# EAGLE schematic mainboard (EAGLE 8.7.1)
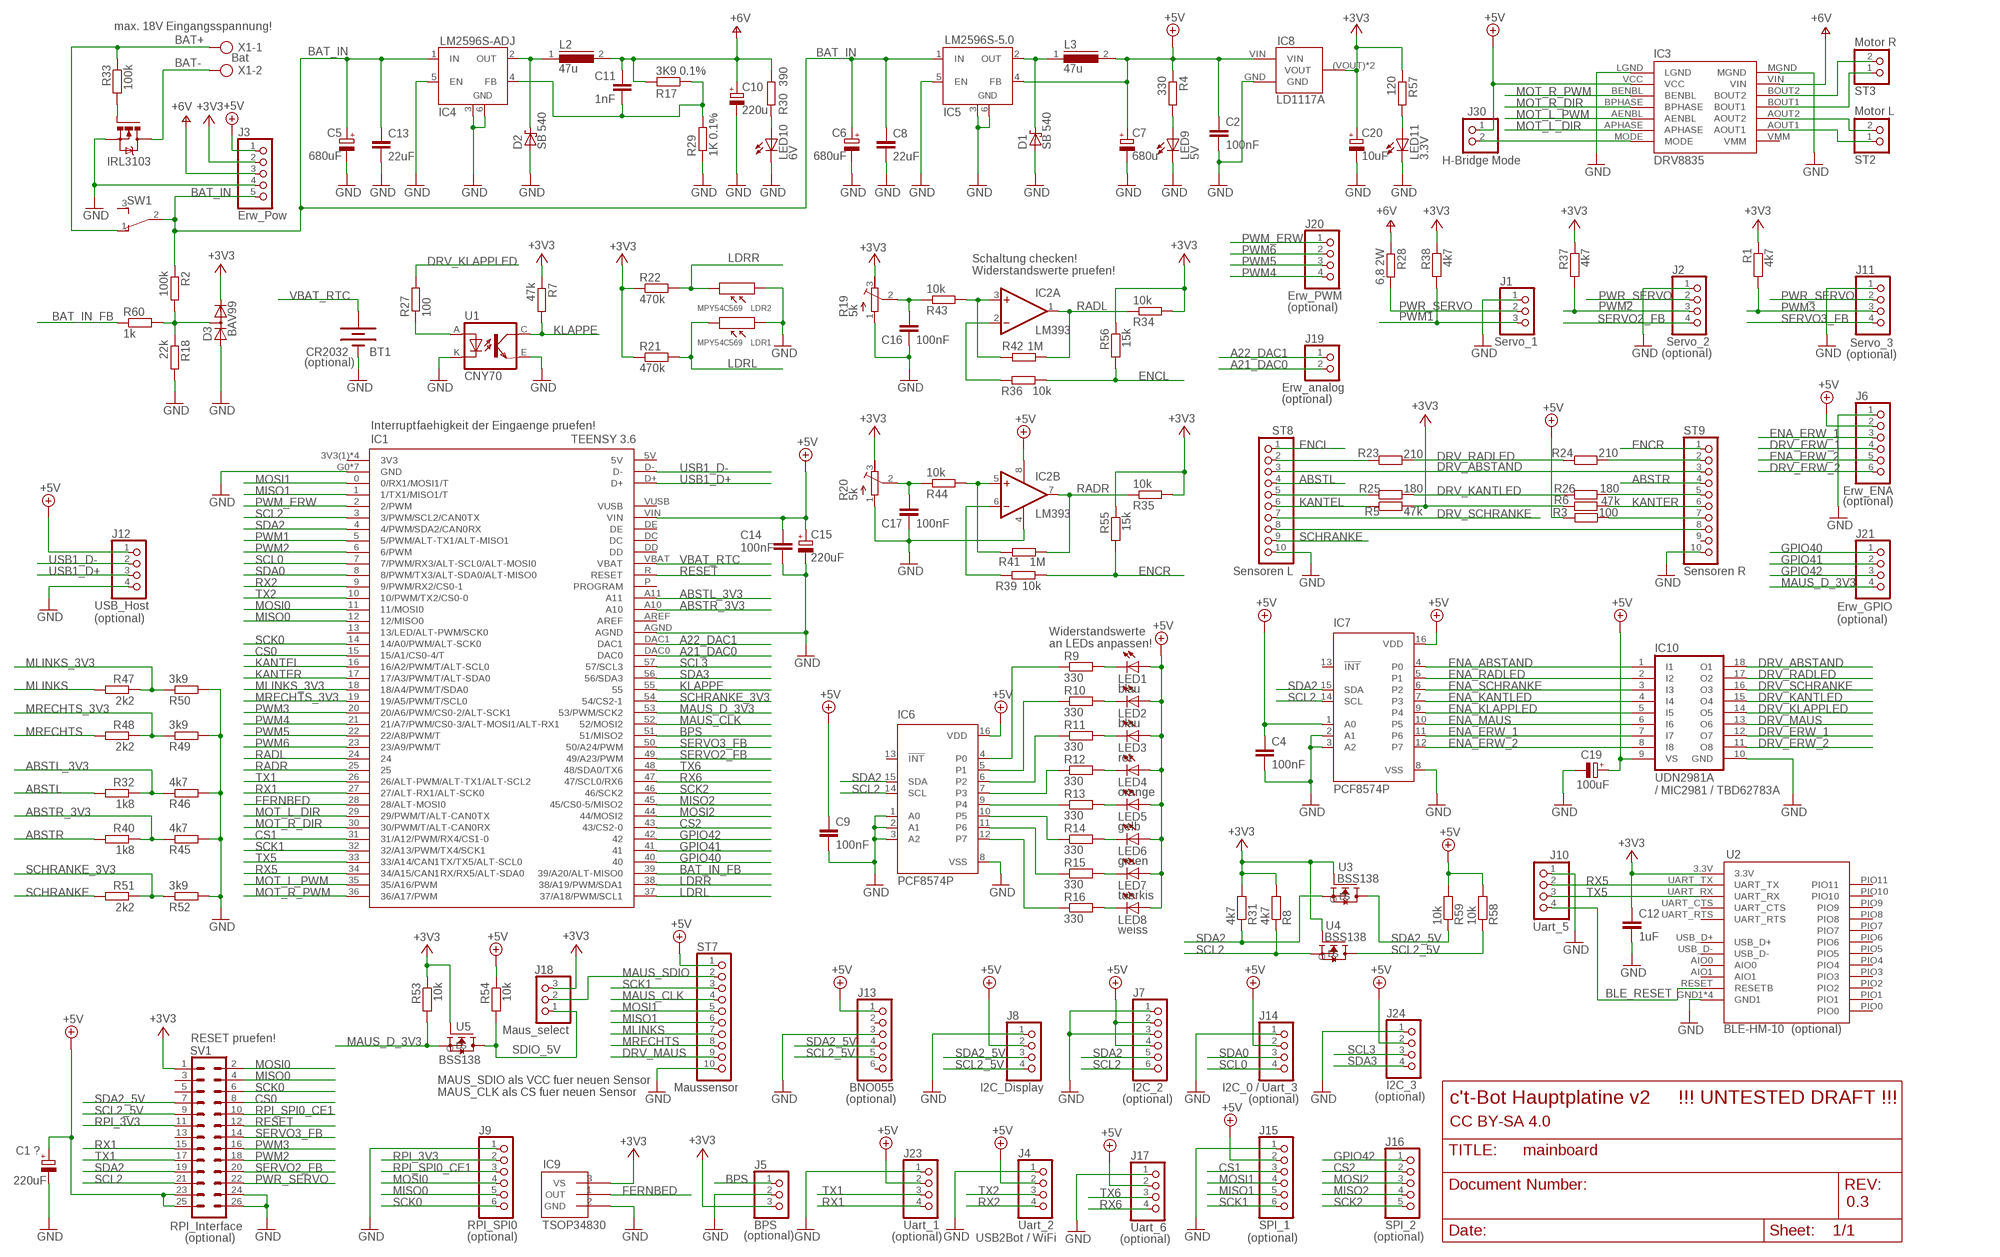
[diagram p0: schematic, sheet 1]

## Parts
BT1  CR2032  BATTERY-20MM_PTH  [BATTCOM_20MM_PTH]
C1  220uF  CPOL-EUE2-5  [E2-5]
C2  100nF  C-EU025-025X050  [C025-025X050]
C4  100nF  C-EU025-025X050  [C025-025X050]
C5  680uF  CPOL-EUE5-10.5  [E5-10,5]
C6  680uF  CPOL-EUE5-10.5  [E5-10,5]
C7  680u  CPOL-EUE5-10.5  [E5-10,5]
C8  22uF  C-EU025-025X050  [C025-025X050]
C9  100nF  C-EU025-025X050  [C025-025X050]
C10  220u  CPOL-EUE5-10.5  [E5-10,5]
C11  1nF  C-EU025-025X050  [C025-025X050]
C12  1uF  C-EU025-025X050  [C025-025X050]
C13  22uF  C-EU025-025X050  [C025-025X050]
C14  100nF  C-EU025-025X050  [C025-025X050]
C15  220uF  CPOL-EUE2-5  [E2-5]
C16  100nF  C-EU025-025X050  [C025-025X050]
C17  100nF  C-EU025-025X050  [C025-025X050]
C19  100uF  CPOL-EUE2-5  [E2-5]
C20  10uF  CPOL-EUE2.5-5  [E2,5-5]
D1  SB 540  SCHOTTKY-DIODEDO201T15  [DO201T15]
D2  SB 540  SCHOTTKY-DIODEDO201T15  [DO201T15]
D3  BAV99  BAV199  [SOT23]
IC1  TEENSY 3.6  TEENSY3_6--ALLPINS  [T36]
IC2  LM393  LM393N  [DIL08@1]
IC3  DRV8835  POLOLU_MOTOR_DRV8835THROUGHHOLE  [POLOLU_MOTOR_DRV_DRV8835]
IC4  LM2596S-ADJ  LM2596S  [TO263-5]
IC5  LM2596S-5.0  LM2596S  [TO263-5]
IC6  PCF8574P  [DIL16]
IC7  PCF8574P  [DIL16]
IC8  LD1117A  LD1117  [LD1117SOT-223]
IC9  TSOP34830  [TSOP348]
IC10  UDN2981A  [DIL18]
J1  Servo_1  PINHD-1X3  [1X03]
J2  Servo_2  PINHD-1X4  [1X04]
J3  Erw_Pow  PINHD-1X5  [1X05]
J4  Uart_2  PINHD-1X4  [1X04]
J5  BPS  PINHD-1X3  [1X03]
J6  Erw_ENA  PINHD-1X6  [1X06]
J7  I2C_2  PINHD-1X6  [1X06]
J8  I2C_Display  PINHD-1X4  [1X04]
J9  RPI_SPI0  PINHD-1X6  [1X06]
J10  Uart_5  PINHD-1X4  [1X04]
J11  Servo_3  PINHD-1X4  [1X04]
J12  USB_Host  PINHD-1X4  [1X04]
J13  BNO055  PINHD-1X6  [1X06]
J14  I2C_0 / Uart_3  PINHD-1X4  [1X04]
J15  SPI_1  PINHD-1X6  [1X06]
J16  SPI_2  PINHD-1X5  [1X05]
J17  Uart_6  PINHD-1X4  [1X04]
J18  Maus_select  PINHD-1X3  [1X03]
J19  Erw_analog  PINHD-1X2  [1X02]
J20  Erw_PWM  PINHD-1X4  [1X04]
J21  Erw_GPIO  PINHD-1X4  [1X04]
J23  Uart_1  PINHD-1X4  [1X04]
J24  I2C_3  PINHD-1X4  [1X04]
J30  H-Bridge Mode  PINHD-1X2  [1X02]
L2  47u  09HCP  [09HCP]
L3  47u  09HCP  [09HCP]
LDR1  MPY54C569  PHOTORESISTOR-5528-10K(2P-5.0X4.2MM)  [SNR2-3.0]
LDR2  MPY54C569  PHOTORESISTOR-5528-10K(2P-5.0X4.2MM)  [SNR2-3.0]
LED1  blau  LED3MM  [LED3MM]
LED2  blau  LED3MM  [LED3MM]
LED3  rot  LED3MM  [LED3MM]
LED4  orange  LED3MM  [LED3MM]
LED5  gelb  LED3MM  [LED3MM]
LED6  gruen  LED3MM  [LED3MM]
LED7  tuerkis  LED3MM  [LED3MM]
LED8  weiss  LED3MM  [LED3MM]
LED9  5V  LED3MM  [LED3MM]
LED10  6V  LED3MM  [LED3MM]
LED11  3.3V  LED3MM  [LED3MM]
Q2  IRL3103  IRF740  [TO220BV]
R1  4k7  R-EU_0204/2V  [0204V]
R2  100k  R-EU_0204/2V  [0204V]
R3  100  R-EU_0204/2V  [0204V]
R4  330  R-EU_0204/2V  [0204V]
R5  47k  R-EU_0204/2V  [0204V]
R6  47k  R-EU_0204/2V  [0204V]
R7  47k  R-EU_0204/2V  [0204V]
R8  4k7  R-EU_0204/2V  [0204V]
R9  330  R-EU_0204/2V  [0204V]
R10  330  R-EU_0204/2V  [0204V]
R11  330  R-EU_0204/2V  [0204V]
R12  330  R-EU_0204/2V  [0204V]
R13  330  R-EU_0204/2V  [0204V]
R14  330  R-EU_0204/2V  [0204V]
R15  330  R-EU_0204/2V  [0204V]
R16  330  R-EU_0204/2V  [0204V]
R17  3K9 0.1%  R-EU_0204/2V  [0204V]
R18  22k  R-EU_0204/2V  [0204V]
R19  5k  R-TRIMM64W  [RTRIM64W]
R20  5k  R-TRIMM64W  [RTRIM64W]
R21  470k  R-EU_0204/2V  [0204V]
R22  470k  R-EU_0204/2V  [0204V]
R23  210  R-EU_0204/2V  [0204V]
R24  210  R-EU_0204/2V  [0204V]
R25  180  R-EU_0204/2V  [0204V]
R26  180  R-EU_0204/2V  [0204V]
R27  100  R-EU_0204/2V  [0204V]
R28  6,8 2W  R-EU_0204/7  [0204/7]
R29  1K 0.1%  R-EU_0204/2V  [0204V]
R30  390  R-EU_0204/2V  [0204V]
R31  4k7  R-EU_0204/2V  [0204V]
R32  1k8  R-EU_0204/2V  [0204V]
R33  100k  R-EU_0204/2V  [0204V]
R34  10k  R-EU_0204/2V  [0204V]
R35  10k  R-EU_0204/2V  [0204V]
R36  10k  R-EU_0204/7  [0204/7]
R37  4k7  R-EU_0204/2V  [0204V]
R38  4k7  R-EU_0204/2V  [0204V]
R39  10k  R-EU_0204/2V  [0204V]
R40  1k8  R-EU_0204/7  [0204/7]
R41  1M  R-EU_0204/2V  [0204V]
R42  1M  R-EU_0204/2V  [0204V]
R43  10k  R-EU_0204/2V  [0204V]
R44  10k  R-EU_0204/2V  [0204V]
R45  4k7  R-EU_0204/7  [0204/7]
R46  4k7  R-EU_0204/2V  [0204V]
R47  2k2  R-EU_0204/2V  [0204V]
R48  2k2  R-EU_0204/2V  [0204V]
R49  3k9  R-EU_0204/2V  [0204V]
R50  3k9  R-EU_0204/2V  [0204V]
R51  2k2  R-EU_0204/2V  [0204V]
R52  3k9  R-EU_0204/2V  [0204V]
R53  10k  R-EU_0204/2V  [0204V]
R54  10k  R-EU_0204/7  [0204/7]
R55  15k  R-EU_0204/2V  [0204V]
R56  15k  R-EU_0204/2V  [0204V]
R57  120  R-EU_0204/2V  [0204V]
R58  10k  R-EU_0204/2V  [0204V]
R59  10k  R-EU_0204/2V  [0204V]
R60  1k  R-EU_0204/2V  [0204V]
ST2  Motor L  PINHD-1X2/90  [1X02/90]
ST3  Motor R  PINHD-1X2/90  [1X02/90]
ST7  Maussensor  PINHD-1X10  [1X10]
ST8  Sensoren L  PINHD-1X10  [1X10]
ST9  Sensoren R  PINHD-1X10  [1X10]
SV1  RPI_Interface  ML26  [ML26]
SW1  TL36WO  [TL3XWO]
U1  CNY70  [4]
U2  BLE-HM-10  RANDOM-PARTS_BLE-HM-10  [RANDOM-PARTS_BLE-HM-10]
U3  BSS138  [BSS138]
U4  BSS138  [BSS138]
U5  BSS138  [BSS138]
X1  Bat  SCHRAUBKLEMME/2  [AK500/2-H]

## Nets
+3V3: C12.1 C20.+ D3.2(C) IC8.(VOUT)(VOUT) IC8.VOUT IC9.3(VS) J3.2 J5.3 J18.3 R1.1 R5.2 R6.1 R7.1 R8.2 R19.3(E) R20.3(E) R21.1 R22.1 R31.2 R34.2 R35.2 R37.1 R38.1 R53.1 R55.1 R56.1 R57.1 SV1.1 U2.3.3V U3.G U4.G U5.G
+5V: C1.+ C2.1 C4.1 C7.+ C9.1 C14.1 C15.+ C19.+ IC1.VIN IC2.8(P:V+) IC3.VCC IC5.4(FB) IC6.16(VDD) IC7.1(A0) IC7.16(VDD) IC8.VIN IC10.9(VS) J3.1 J4.2 J6.2 J7.2 J7.4 J8.2 J12.1 J13.1 J14.2 J15.2 J17.2 J23.2 J24.2 J30.1 L3.2 LED1.A LED2.A LED3.A LED4.A LED5.A LED6.A LED7.A LED8.A R3.2 R4.1 R54.1 R58.2 R59.2 ST7.1 SV1.23 SV1.25
+6V: C10.+ C11.1 IC3.VIN J3.3 L2.2 R17.2 R28.1 R30.1
A21_DAC0: IC1.DAC0 J19.2
A22_DAC1: IC1.DAC1 J19.1
ABSTL: R32.2 ST8.4
ABSTL_3V3: IC1.A11 R32.1 R46.1
ABSTR: R40.2 ST9.4
ABSTR_3V3: IC1.A10 R40.1 R45.1
BAT+: R33.1 SW1.1(O) X1.1
BAT-: Q2.D X1.2
BAT_IN: C5.+ C6.+ C8.1 C13.1 IC4.1(IN) IC5.1(IN) J3.5 R2.1 SW1.2(P)
BAT_IN_FB: IC1.39(39/A20/ALT-MISO0) R60.1
BLE_RESET: J10.4 U2.RESET(RESETB)
BPS: IC1.51(51/MISO2) J5.1
CS0: IC1.15(15/A1/CS0-4/T) SV1.8
CS1: IC1.31(31/A12/PWM/RX4/CS1-0) J15.3
CS2: IC1.43(43/CS2-0) J16.2
DRV_ABSTAND: IC10.18(O1) ST8.3 ST9.3
DRV_ERW_1: IC10.12(O7) J6.4
DRV_ERW_2: IC10.11(O8) J6.6
DRV_KANTLED: IC10.15(O4) R25.2 R26.1
DRV_KLAPPLED: IC10.14(O5) R27.2
DRV_MAUS: IC10.13(O6) ST7.9
DRV_RADLED: IC10.17(O2) R23.2 R24.1
DRV_SCHRANKE: IC10.16(O3) ST8.7
ENA_ABSTAND: IC7.4(P0) IC10.1(I1)
ENA_ERW_1: IC7.11(P6) IC10.7(I7) J6.3
ENA_ERW_2: IC7.12(P7) IC10.8(I8) J6.5
ENA_KANTLED: IC7.7(P3) IC10.4(I4)
ENA_KLAPPLED: IC7.9(P4) IC10.5(I5)
ENA_MAUS: IC7.10(P5) IC10.6(I6)
ENA_RADLED: IC7.5(P1) IC10.2(I2)
ENA_SCHRANKE: IC7.6(P2) IC10.3(I3)
ENCL: R36.1 R56.2 ST8.1
ENCR: R39.1 R55.2 ST9.1
FERNBED: IC1.28(28/ALT-MOSI0) IC9.1(OUT)
GND: BT1.2(-) C1.- C2.2 C4.2 C5.- C6.- C7.- C8.2 C9.2 C10.- C12.2 C13.2 C14.2 C15.- C16.2 C17.2 C19.- C20.- D1.A D2.A D3.1(A) IC1.AGND IC1.G0(GND) IC1.G1(GND) IC1.G2(GND) IC1.G3(GND) IC1.G4(GND) IC1.G5(GND) IC1.G6(GND) IC2.4(P:V-) IC3.LGND IC3.MGND IC4.3(GND) IC4.5(EN) IC4.6(GND) IC5.3(GND) IC5.5(EN) IC5.6(GND) IC6.1(A0) IC6.2(A1) IC6.3(A2) IC6.8(VSS) IC7.2(A1) IC7.3(A2) IC7.8(VSS) IC8.GND IC9.2(GND) IC10.10(GND) J1.1 J2.1 J3.4 J4.1 J5.2 J6.1 J7.1 J7.3 J8.1 J9.1 J10.1 J11.1 J12.4 J13.3 J14.1 J15.1 J17.1 J23.1 J24.1 LDR1.1 LDR2.1 LED9.K(C) LED10.K(C) LED11.K(C) Q2.S R18.2 R19.1(A) R20.1(A) R29.1 R45.2 R46.2 R49.2 R50.2 R52.2 ST7.10 ST8.10 ST9.10 SV1.24 SV1.26 U1.E(EMI) U1.K(C) U2.GND1 U2.GND2(GND1) U2.GND3(GND1) U2.GND4(GND1)
GPIO40: IC1.40 J21.1
GPIO41: IC1.41 J21.2
GPIO42: IC1.42 J16.1 J21.3
KANTEL: IC1.16(16/A2/PWM/T/ALT-SCL0) R5.1 ST8.6
KANTER: IC1.17(17/A3/PWM/T/ALT-SDA0) R6.2 ST9.6
KLAPPE: IC1.55 R7.2 U1.C(COL)
KLAPPLED: R27.1 U1.A
LDRL: IC1.37(37/A18/PWM/SCL1) LDR1.2 R21.2
LDRR: IC1.38(38/A19/PWM/SDA1) LDR2.2 R22.2
MAUS_CLK: IC1.52(52/MOSI2) ST7.4
MAUS_D_3V3: IC1.53(53/PWM/SCK2) J21.4 R53.2 U5.S
MAUS_SDIO: J18.2 ST7.2
MISO0: IC1.12(12/MISO0) J9.5 SV1.4
MISO1: IC1.1(1/TX1/MISO1/T) J15.5 ST7.6
MISO2: IC1.45(45/CS0-5/MISO2) J16.4
MLINKS: R47.2 ST7.7
MLINKS_3V3: IC1.18(18/A4/PWM/T/SDA0) R47.1 R50.1
MOSI0: IC1.11(11/MOSI0) J9.4 SV1.2
MOSI1: IC1.0(0/RX1/MOSI1/T) J15.4 ST7.5
MOSI2: IC1.44(44/MOSI2) J16.3
MOT_L_1: IC3.AOUT1 ST2.1
MOT_L_2: IC3.AOUT2 ST2.2
MOT_L_DIR: IC1.29(29/PWM/T/ALT-CAN0TX) IC3.APHASE
MOT_L_PWM: IC1.35(35/A16/PWM) IC3.AENBL
MOT_R_1: IC3.BOUT1 ST3.1
MOT_R_2: IC3.BOUT2 ST3.2
MOT_R_DIR: IC1.30(30/PWM/T/ALT-CAN0RX) IC3.BPHASE
MOT_R_PWM: IC1.36(36/A17/PWM) IC3.BENBL
MRECHTS: R48.2 ST7.8
MRECHTS_3V3: IC1.19(19/A5/PWM/T/SCL0) R48.1 R49.1
N$1: R3.1 ST9.7
N$2: LED11.A R57.2
N$3: IC3.MODE J30.2
N$4: D3.3(AC) R2.2 R18.1 R60.2
N$5: C11.2 IC4.4(FB) R17.1 R29.2
N$6: LED9.A R4.2
N$8: LED10.A R30.2
N$10: IC2.3(A:+IN) R42.1 R43.2
N$12: IC2.5(B:+IN) R41.1 R44.2
N$13: IC2.2(A:-IN) R36.2
N$14: IC2.6(B:-IN) R39.2
N$16: IC6.9(P4) R13.1
N$17: IC6.7(P3) R12.1
N$18: IC6.6(P2) R11.1
N$19: IC6.5(P1) R10.1
N$20: IC6.4(P0) R9.1
N$21: IC6.10(P5) R14.1
N$22: IC6.11(P6) R15.1
N$23: IC6.12(P7) R16.1
N$25: LED8.K(C) R16.2
N$26: LED1.K(C) R9.2
N$27: LED2.K(C) R10.2
N$28: LED3.K(C) R11.2
N$29: LED4.K(C) R12.2
N$30: LED5.K(C) R13.2
N$31: LED6.K(C) R14.2
N$32: LED7.K(C) R15.2
N$35: C16.1 R19.2(S) R43.1
N$38: Q2.G R33.2
N$39: C17.1 R20.2(S) R44.1
N$45: R24.2 ST9.2
N$47: R23.1 ST8.2
N$51: R25.1 ST8.5
N$53: R26.2 ST9.5
N$57: ST8.8 ST9.8
PWM1: IC1.5(5/PWM/ALT-TX1/ALT-MISO1) J1.3 R38.2
PWM2: IC1.6(6/PWM) J2.3 R37.2 SV1.18
PWM3: IC1.20(20/A6/PWM/CS0-2/ALT-SCK1) J11.3 R1.2 SV1.16
PWM4: IC1.21(21/A7/PWM/CS0-3/ALT-MOSI1/ALT-RX1) J20.4
PWM5: IC1.22(22/A8/PWM/T) J20.3
PWM6: IC1.23(23/A9/PWM/T) J20.2
PWM_ERW: IC1.2(2/PWM) J20.1
PWR_SERVO: J1.2 J2.2 J11.2 R28.2 SV1.22
RADL: IC1.24 IC2.1(A:OUT) R34.1 R42.2
RADR: IC1.25 IC2.7(B:OUT) R35.1 R41.2
RESET: IC1.R(RESET) SV1.12
RPI_3V3: J9.2 SV1.11
RPI_SPI0_CE1: J9.3 SV1.10
RX1: IC1.27(27/ALT-RX1/ALT-SCK0) J23.4 SV1.15
RX2: IC1.9(9/PWM/RX2/CS0-1) J4.4
RX5: IC1.34(34/A15/CAN1RX/RX5/ALT-SDA0) J10.2 U2.UART_TX
RX6: IC1.47(47/SCL0/RX6) J17.4
SCHRANKE: R51.2 ST8.9
SCHRANKE_3V3: IC1.54(54/CS2-1) R51.1 R52.1
SCK0: IC1.14(14/A0/PWM/ALT-SCK0) J9.6 SV1.6
SCK1: IC1.32(32/A13/PWM/TX4/SCK1) J15.6 ST7.3
SCK2: IC1.46(46/SCK2) J16.5
SCL0: IC1.7(7/PWM/RX3/ALT-SCL0/ALT-MOSI0) J14.4
SCL2: IC1.3(3/PWM/SCL2/CAN0TX) IC6.14(SCL) IC7.14(SCL) J7.6 R8.1 SV1.21 U4.S
SCL2_5V: J8.4 J13.5 R58.1 SV1.9 U4.D
SCL3: IC1.57(57/SCL3) J24.3
SDA0: IC1.8(8/PWM/TX3/ALT-SDA0/ALT-MISO0) J14.3
SDA2: IC1.4(4/PWM/SDA2/CAN0RX) IC6.15(SDA) IC7.15(SDA) J7.5 R31.1 SV1.19 U3.S
SDA2_5V: J8.3 J13.4 R59.1 SV1.7 U3.D
SDA3: IC1.56(56/SDA3) J24.4
SDIO_5V: J18.1 R54.2 U5.D
SERVO2_FB: IC1.49(49/A23/PWM) J2.4 SV1.20
SERVO3_FB: IC1.50(50/A24/PWM) J11.4 SV1.14
TX1: IC1.26(26/ALT-PWM/ALT-TX1/ALT-SCL2) J23.3 SV1.17
TX2: IC1.10(10/PWM/TX2/CS0-0) J4.3
TX5: IC1.33(33/A14/CAN1TX/TX5/ALT-SCL0) J10.3 U2.UART_RX
TX6: IC1.48(48/SDA0/TX6) J17.3
USB1_D+: IC1.D+ J12.3
USB1_D-: IC1.D- J12.2
V5_L1: D1.C IC5.2(OUT) L3.1
V6_L1: D2.C IC4.2(OUT) L2.1
VBAT_RTC: BT1.1(+) IC1.VBAT
Unconnected: IC1.3V3(1)(3V3) IC1.3V3(2)(3V3) IC1.3V3(3)(3V3) IC1.3V3(4)(3V3) IC1.5V IC1.13(13/LED/ALT-PWM/SCK0) IC1.AREF IC1.DC IC1.DD IC1.DE IC1.P(PROGRAM) IC1.VUSB IC3.VMM IC6.13(!INT) IC7.13(!INT) J13.2 J13.6 ST9.9 SV1.3 SV1.5 SV1.13 SW1.3(S) U2.AIO0 U2.AIO1 U2.PIO0 U2.PIO1 U2.PIO2 U2.PIO3 U2.PIO4 U2.PIO5 U2.PIO6 U2.PIO7 U2.PIO8 U2.PIO9 U2.PIO10 U2.PIO11 U2.UART_CTS U2.UART_RTS U2.USB_D+ U2.USB_D-

## Notes on the sheet
- max. 18V Eingangsspannung!
- Schaltung checken!
  Widerstandswerte pruefen!
- (optional)
- (optional) | (optional)
- (optional)
- (optional)
- Interruptfaehigkeit der Eingaenge pruefen!
- (optional)
- (optional) | (optional)
- Widerstandswerte
  an LEDs anpassen!
- / MIC2981 / TBD62783A
- (optional)
- RESET pruefen!
- MAUS_SDIO als VCC fuer neuen Sensor
  MAUS_CLK als CS fuer neuen Sensor
- (optional) | (optional) | (optional) | (optional)
- c't-Bot Hauptplatine v2     !!! UNTESTED DRAFT !!!
- CC BY-SA 4.0
- ?
- 0.3
- (optional) | (optional) | (optional) | (optional) | USB2Bot / WiFi | (optional) | (optional)
- (optional)

## Library data of the parts
BT1 = SparkFun-Batteries:BATTERY: Battery - Single Cell A variety of battery chemistries, sizes, and footprints. Device List: 20MM_PTH - Coin Cell Battery Holder - 20mm (PTH) <https://www.sparkfun.com/products/783> 6.8MM_PTH - Coin Cell Battery Holder - 6.8MM(SMD) <https://www.digikey.com/product-detail/en/seiko-instruments/MS621FE-FL11E/728-1057-ND/1889208?WT.srch=1&gclid=CNOQ5a6LzdQCFZS2wAodXCkE0g> 12MM_SMD - Coin Cell Battery Holder - 12mm (SMD) <https://www.sparkfun.com/products/10592> 12MM_PTH - Coin Cell Battery Holder - 12mm (PTH) <https://www.sparkfun.com/products/7948> 20MM_SMD - 20mm Coin Cell Battery Holder (SMD) (2 legs) Used on the Big Time Watch Kit <https://www.sparkfun.com/products/11734> 20MM_SMD_4LEGS - Coin Cell Battery Holder - 20mm (SMD) <https://www.sparkfun.com/products/11892> 20MM_SMD_4LEGS_OVERPASTE - Coin Cell Battery Holder - 20mm (SMD) <https://www.sparkfun.com/products/11892> (Over-paste on the legs) 24.5MM_PTH - Coin Cell Battery Holder - 24.5mm (PTH) <https://www.sparkfun.com/products/8863> 9V - 9V Battery Holder - PC Mount Used on the SparkFun SparkPunk Sound Kit <https://www.sparkfun.com/products/11177> and SparkFun SparkPunk Sequencer Kit <https://www.sparkfun.com/products/12707> 18650 - Battery Holder - 18650 (PTH) <https://www.sparkfun.com/products/13113> AA - Battery Holder - 1xAA (PTH) <https://www.sparkfun.com/products/7949> AAA - Battery Holder - 1xAAA (PTH) <https://www.sparkfun.com/products/12718> AA_KIT - Battery Holder - 1xAA (PTH) <https://www.sparkfun.com/products/7949> Special kit package - pads only have exposed copper on one side of the board. AAA_KIT - Battery Holder - 1xAAA (PTH) <https://www.sparkfun.com/products/12718> Special kit package - pads only have exposed copper on one side of the board.; PROD_ID: BATT-09031; SF_SKU: PRT-00783
C1 C15 C19 C20 = rcl:CPOL-EU: POLARIZED CAPACITOR, European symbol; SPICEPREFIX: C
C2 C4 C9 C12 C14 C16 C17 = rcl:C-EU: CAPACITOR, European symbol; SPICEPREFIX: C
C5-C7 C10 = rcl:CPOL-EU: POLARIZED CAPACITOR, European symbol
C8 C11 C13 = rcl:C-EU: CAPACITOR, European symbol
D1 D2 = diode:SCHOTTKY-DIODE: Schottky Diode
D3 = diode:BAV199: DIODE low-leakage double diode
IC1 = Teensy_3_6:TEENSY3_6--ALLPINS
IC2 = linear:LM393: COMPARATOR; SPICEPREFIX: J
IC3 = pololu:POLOLU_MOTOR_DRV8835
IC4 IC5 = linear:LM2596S: STEP-DOWN VOLTAGE REGULATOR
IC6 IC7 = micro-philips:PCF8574: I2C-Bus Remote 8-bit I/O expander http://www.semiconductors.philips.com/acrobat_download/datasheets/PCF8574_4.pdf; MPN: PCF8574PN; OC_FARNELL: 204020; OC_NEWARK: 11N8515
IC8 = LD1117:LD1117
IC9 = vishay-1:TSOP348*: IR Receiver Modules for Remote Control Systems http://www.vishay.com/ir-receiver-modules/
IC10 = uln-udn:UDN298*: DRIVER ARRAY Source: Allegro Microsystems Inc. / UDN2981-UDN2984.pdf
J1 J5 J18 = pinhead_ts:PINHD-1X3: PIN HEADER
J2 J4 J8 J10-J12 J14 J17 J20 J23 J24 = pinhead_ts:PINHD-1X4: PIN HEADER
J3 J16 = pinhead_ts:PINHD-1X5: PIN HEADER
J6 J7 J9 J13 J15 = pinhead_ts:PINHD-1X6: PIN HEADER
J19 J30 ST2 ST3 = pinhead_ts:PINHD-1X2: PIN HEADER
J21 = pinhead_ts:PINHD-1X4: PIN HEADER; SPICEPREFIX: E
L2 L3 = inductors:09HCP: INDUCTOR
LDR1 LDR2 = Seeed-Sensor:PHOTORESISTOR-5528-10K(2P-5.0X4.2MM): 314020017; MPN: PHOTORESISTOR-5528-10K; VALUE: PHOTORESISTOR-5528-10K
LED1-LED11 = led:LED: LED OSRAM: - CHIPLED LG R971, LG N971, LY N971, LG Q971, LY Q971, LO R971, LY R971 LH N974, LH R974 LS Q976, LO Q976, LY Q976 LO Q996 - Hyper CHIPLED LW Q18S LB Q993, LB Q99A, LB R99A - SideLED LS A670, LO A670, LY A670, LG A670, LP A670 LB A673, LV A673, LT A673, LW A673 LH A674 LY A675 LS A676, LA A676, LO A676, LY A676, LW A676 LS A679, LY A679, LG A679 - Hyper Micro SIDELED® LS Y876, LA Y876, LO Y876, LY Y876 LT Y87S - SmartLED LW L88C, LW L88S LB L89C, LB L89S, LG L890 LS L89K, LO L89K, LY L89K LS L896, LA L896, LO L896, LY L896 - TOPLED LS T670, LO T670, LY T670, LG T670, LP T670 LSG T670, LSP T670, LSY T670, LOP T670, LYG T670 LG T671, LOG T671, LSG T671 LB T673, LV T673, LT T673, LW T673 LH T674 LS T676, LA T676, LO T676, LY T676, LB T676, LH T676, LSB T676, LW T676 LB T67C, LV T67C, LT T67C, LS T67K, LO T67K, LY T67K, LW E67C LS E67B, LA E67B, LO E67B, LY E67B, LB E67C, LV E67C, LT E67C LW T67C LS T679, LY T679, LG T679 LS T770, LO T770, LY T770, LG T770, LP T770 LB T773, LV T773, LT T773, LW T773 LH T774 LS E675, LA E675, LY E675, LS T675 LS T776, LA T776, LO T776, LY T776, LB T776 LHGB T686 LT T68C, LB T68C - Hyper Mini TOPLED® LB M676 - Mini TOPLED Santana® LG M470 LS M47K, LO M47K, LY M47K Source: http://www.osram.convergy.de LUXEON: - LUMILED® LXK2-PW12-R00, LXK2-PW12-S00, LXK2-PW14-U00, LXK2-PW14-V00 LXK2-PM12-R00, LXK2-PM12-S00, LXK2-PM14-U00 LXK2-PE12-Q00, LXK2-PE12-R00, LXK2-PE12-S00, LXK2-PE14-T00, LXK2-PE14-U00 LXK2-PB12-K00, LXK2-PB12-L00, LXK2-PB12-M00, LXK2-PB14-N00, LXK2-PB14-P00, LXK2-PB14-Q00 LXK2-PR12-L00, LXK2-PR12-M00, LXK2-PR14-Q00, LXK2-PR14-R00 LXK2-PD12-Q00, LXK2-PD12-R00, LXK2-PD12-S00 LXK2-PH12-R00, LXK2-PH12-S00 LXK2-PL12-P00, LXK2-PL12-Q00, LXK2-PL12-R00 Source: www.luxeon.com KINGBRIGHT: KA-3528ASYC Source: www.kingbright.com
Q2 = transistor-power:IRF740: N-CHANNEL MOS FET
R1-R3 R5-R16 R18 R21-R28 R31-R56 R58-R60 = rcl:R-EU_: RESISTOR, European symbol; SPICEPREFIX: R
R4 R30 R57 = resistor:R-EU_: RESISTOR, European symbol
R17 R29 = rcl:R-EU_: RESISTOR, European symbol
R19 R20 = rcl:R-TRIMM: Trimm resistor; SPICEMODEL: X; SPICEPREFIXL: POT
ST7-ST9 = pinhead_ts:PINHD-1X10: PIN HEADER
SV1 = con-harting-ml:ML26: HARTING; OC_FARNELL: unknown; OC_NEWARK: unknown
SW1 = switch:TL36WO: TINY SWITCH ON - ON Source: http://www2.produktinfo.conrad.com/datenblaetter/700000-724999/705152-da-01-de-Subminiaturschalter_TL_36WO.pdf
U1 = cny70:CNY70; SPICEPREFIX: E
U2 = BLE_HM-10:RANDOM-PARTS_BLE-HM-10
U3-U5 = Ava:BSS138: BSS138 N-Channel Logic Level Enhancement Mode Field Effect Transistor
X1 = mylib:SCHRAUBKLEMME/2; OC_FARNELL: unknown; OC_NEWARK: unknown

## Net classes
0 default: width 0.152 mm
1 power: width 0.152 mm